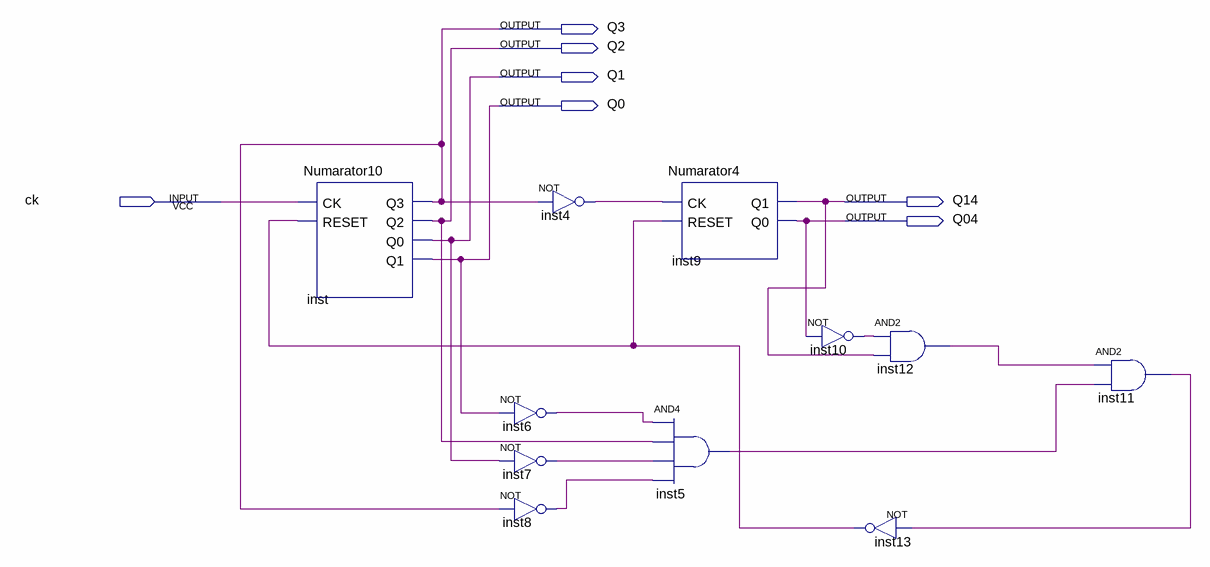
[diagram p0: schematic sheet]
// Quartus schematic numOre.bdf as structural Verilog: 11 symbols, 7 pins
module numOre (
  input  ck,
  output Q3,
  output Q2,
  output Q1,
  output Q0,
  output Q14,
  output Q04
);

  wire inst4_out, inst5_out, inst6_out, inst7_out, inst8_out, inst10_out, inst11_out, inst12_out, inst13_out;

  Numarator10 inst (.CK(ck), .RESET(inst13_out), .Q3(Q3), .Q2(Q2), .Q0(Q1), .Q1(Q0));
  not inst4 (inst4_out, Q3);
  not inst6 (inst6_out, Q0);
  not inst7 (inst7_out, Q1);
  not inst8 (inst8_out, Q3);
  Numarator4 inst9 (.CK(inst4_out), .RESET(inst13_out), .Q1(Q14), .Q0(Q04));
  and inst5 (inst5_out, inst6_out, Q2, inst7_out, inst8_out);
  not inst10 (inst10_out, Q04);
  not inst13 (inst13_out, inst11_out);
  and inst12 (inst12_out, inst10_out, Q14);
  and inst11 (inst11_out, inst12_out, inst5_out);
endmodule
